# EasyEDA schematic SCH_Syntheseproject line follower_2022-10-21.json
TITLE: Line follower; REV: 1.0; Date: 2022-10-13; Sheet: 1/1; Drawn By: victordv; Company: HOGENT
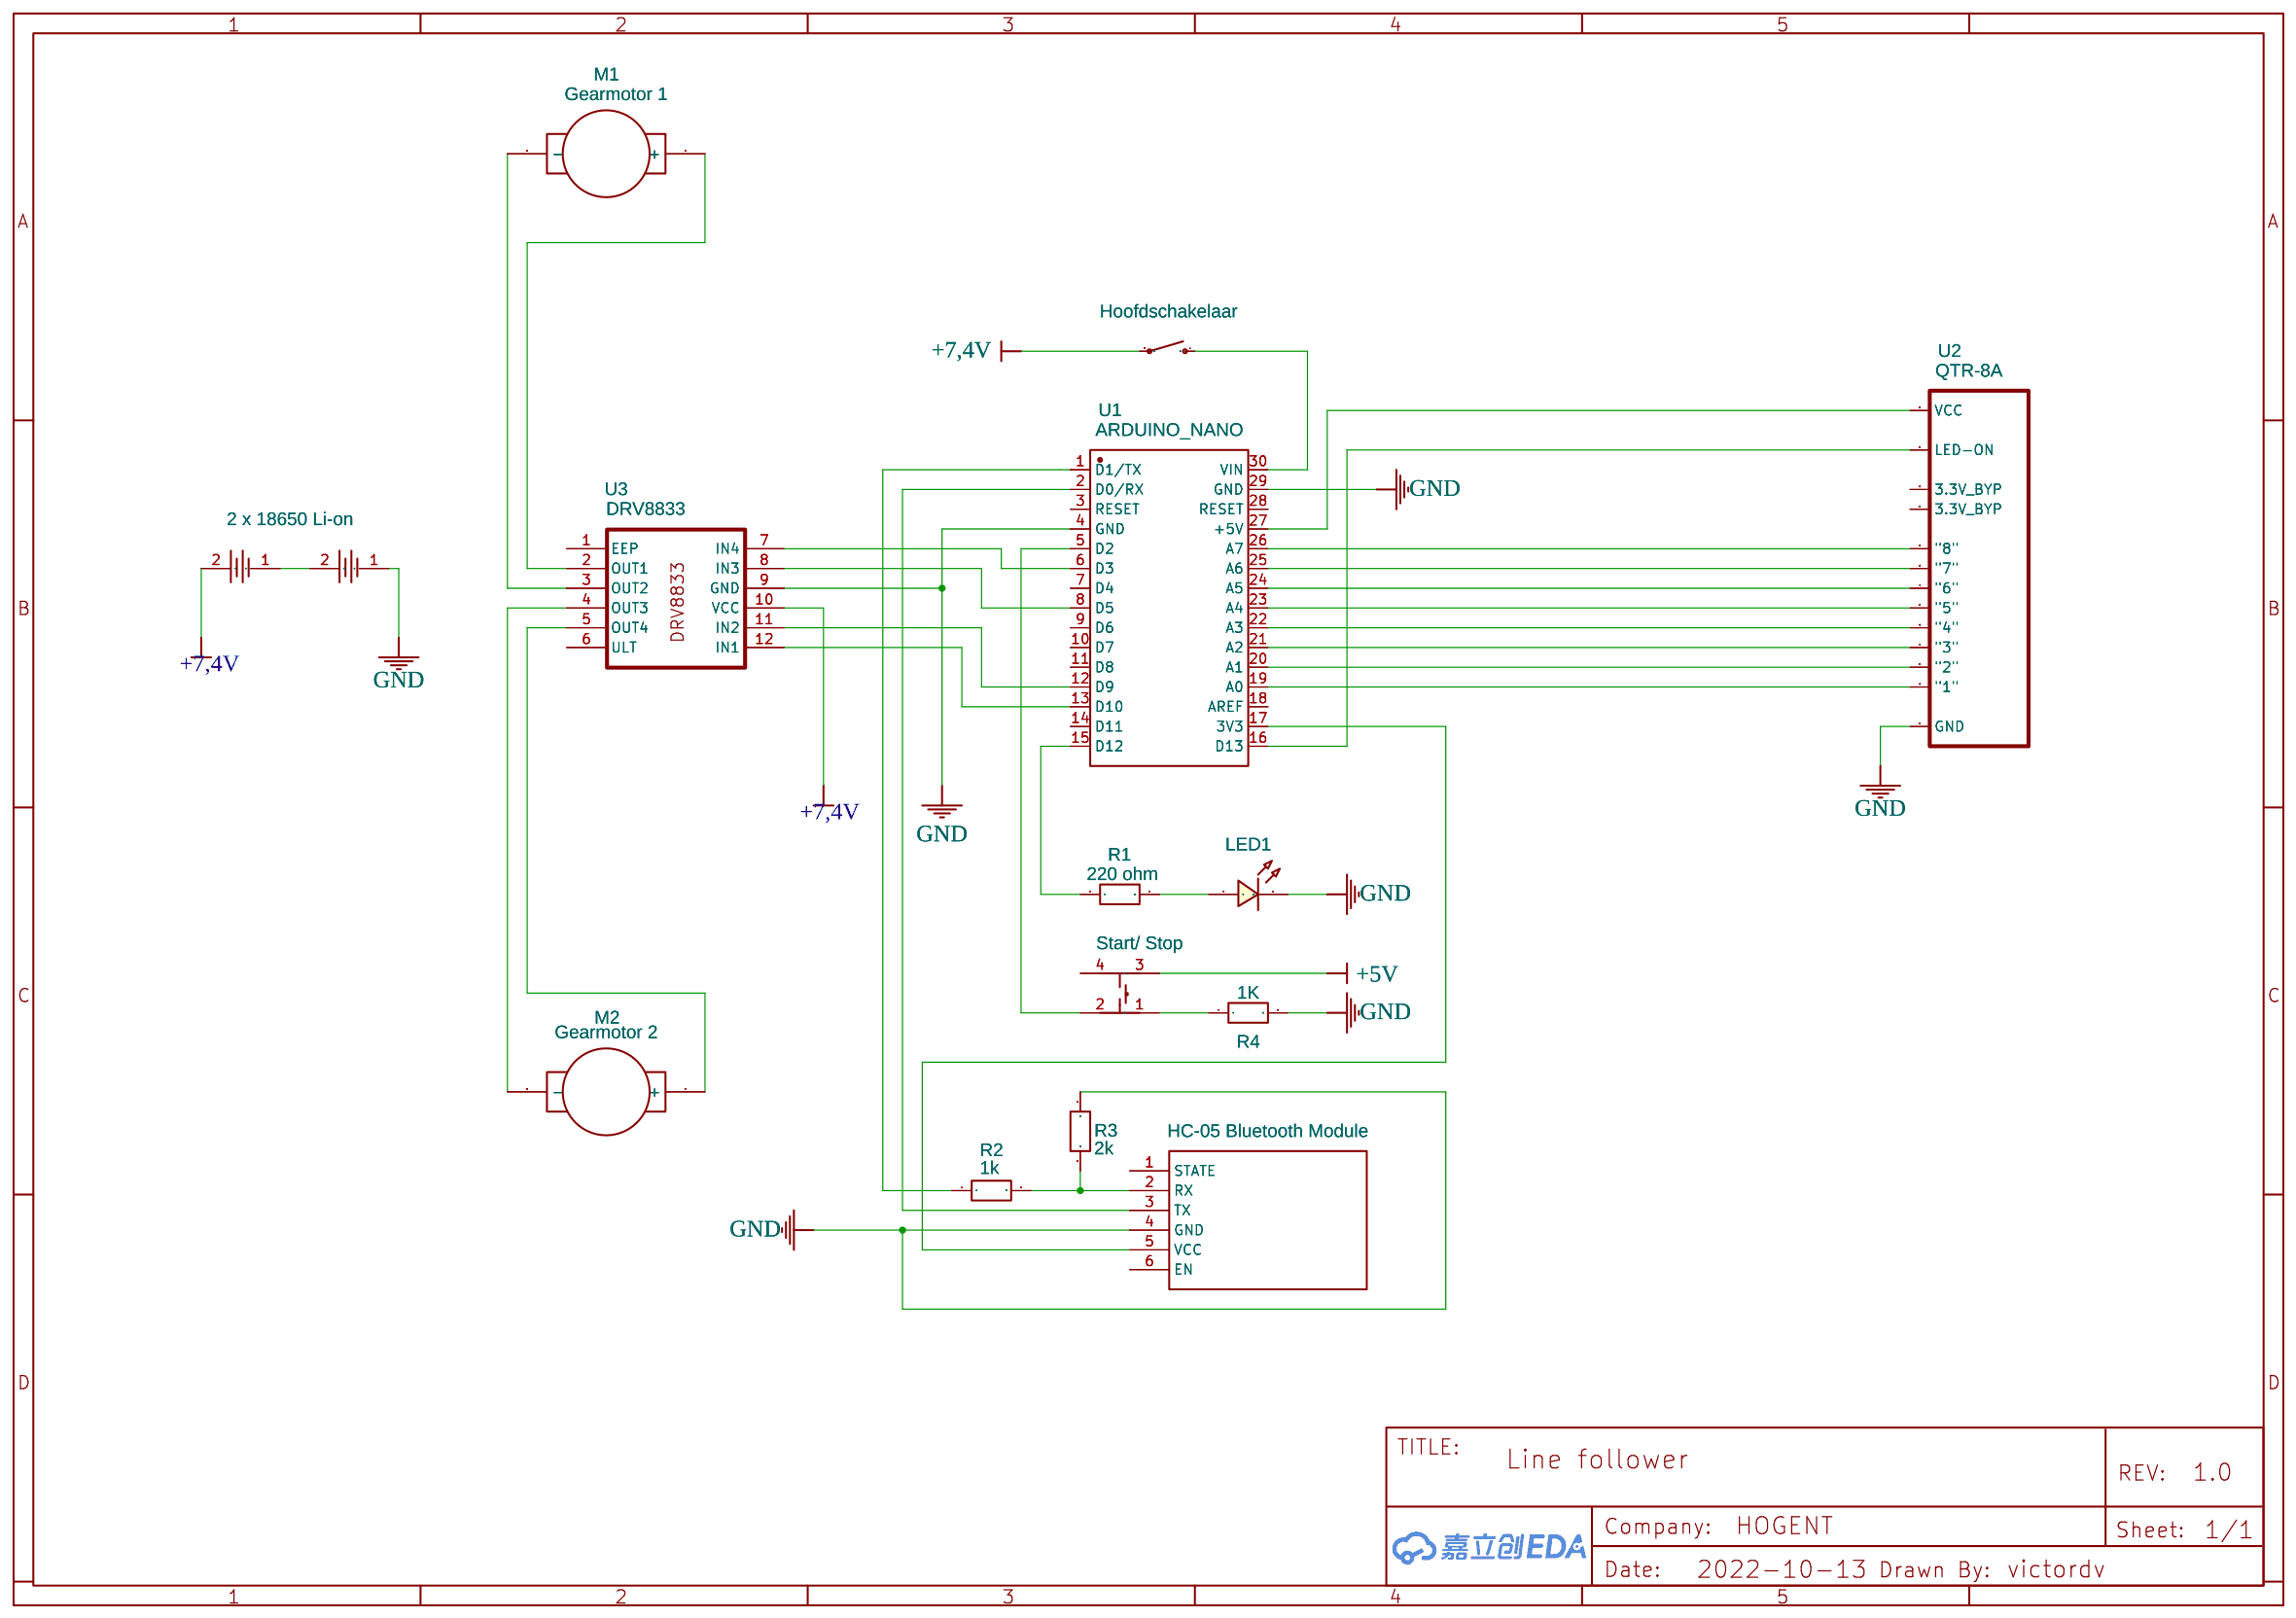
[diagram p0: schematic sheet]

## Parts
BT1  2 x 18650 Li-on  [BATTERY-SMD_18650-1S-L77.1-W20.7-1]
BT2  2 x 18650 Li-on  [BATTERY-SMD_18650-1S-L77.1-W20.7-1]
LED1  LED-0603_R  [LED0603_RED]
M1  Gearmotor 1  [MICRO GEARED DC MOTOR PADS]
M2  Gearmotor 2  [MICRO GEARED DC MOTOR PADS]
R1  220 ohm  [R0603]
R2  1k  [R0603]
R3  2k  [R0603]
R4  1K  [R0603]
SW1  Start/ Stop  [SW-SMD_4P-L4.2-W3.2-P2.15-LS5.2]
U1  ARDUINO_NANO  [COMM-TH_ARDUINO_NANO]
U2  QTR-8A  [QTR-8A/8RC]
U3  DRV8833  [DRV8833 (NO ORIGINAL)]
U4  Hoofdschakelaar  [SWITCHES_TACTILE_SWITCH_SMD_4.6X2.8MM]
U5  HC-05 Bluetooth Module  [HC-05 BLUETOOTH MODULE]

## Library data of the parts
BT1 BT2 = BH-18650-B1BA002: Supplier: LCSC; Supplier Part: C2988620; Manufacturer: MYOUNG(美阳); link: https://atta.szlcsc.com/upload/public/pdf/source/20220402/870DB99AB50CA0DF8D51CF7C86A51FAB.pdf; Contributor: lcsc; JLCPCB Part Class: Extended Part
LED1 = LED-0603_R: Manufacturer: EVERLIGHT(台湾亿光); Manufacturer Part: 19-217/R6C-AL1M2VY/3T; Supplier Part: C72044; Supplier: LCSC; Contributor: LCEDA_01
M1 M2 = Micro Geared DC Motor: link: https://www.amazon.com/dp/B07N7PY71F?psc=1&ref=ppx_yo2ov_dt_b_product_details; Contributor: Guest
R1-R4 = R_0603_EU: Contributor: LCEDA_Lib
SW1 = BUTTON-4X3X2.5: Supplier: LCSC; Supplier Part: C9900020294; Manufacturer: null; JLCPCB Part Class: Extended Part; Contributor: lcsc
U1 = ARDUINO_NANO: Supplier: LCSC; Supplier Part: C9900017879; Manufacturer: null; JLCPCB Part Class: Extended Part; Contributor: lcsc
U2 = QTR-8A: Manufacturer: Pololu; Supplier: Pololu; Supplier Part: 960; link: https://www.pololu.com/docs/pdf/0J12/QTR-8x.pdf; Contributor: Junikos
U3 = DRV8833 (NO ORIGINAL): Contributor: PiterSantaCruz
U4 = SPST Switch: Contributor: baskin1
U5 = HC-05 Bluetooth Module: Contributor: tishangg

## Nets
+5V: SW1.3
GND: BT2.1 LED1.2 R3.1 R4.2 U1.4(GND) U1.29(GND) U2.1(GND) U3.9(GND) U5.4(GND)
+7,4V: BT1.2 U3.10(VCC) U4.2(1)
Net-(BT1-1): BT1.1 BT2.2
Net-(LED1-1): LED1.1 R1.2
Net-(M1-1): M1.1(-) U3.3(OUT2)
Net-(M1-2): M1.2(+) U3.2(OUT1)
Net-(M2-1): M2.1(-) U3.4(OUT3)
Net-(M2-2): M2.2(+) U3.5(OUT4)
Net-(R1-1): R1.1 U1.15(D12)
Net-(R2-1): R2.1 U1.1(D1/TX)
Net-(R2-2): R2.2 R3.2 U5.2(RX)
Net-(R4-1): R4.1 SW1.1
Net-(SW1-2): SW1.2 U1.5(D2)
Net-(U1-2): U1.2(D0/RX) U5.3(TX)
Net-(U1-6): U1.6(D3) U3.7(IN4)
Net-(U1-8): U1.8(D5) U3.8(IN3)
Net-(U1-12): U1.12(D9) U3.11(IN2)
Net-(U1-13): U1.13(D10) U3.12(IN1)
Net-(U1-16): U1.16(D13) U1.27(+5V) U2.12(LED-ON)
Net-(U1-17): U1.17(3V3) U5.5(VCC)
Net-(U1-19): U1.19(A0) U2.2("1")
Net-(U1-20): U1.20(A1) U2.3("2")
Net-(U1-21): U1.21(A2) U2.4("3")
Net-(U1-22): U1.22(A3) U2.5("4")
Net-(U1-23): U1.23(A4) U2.6("5")
Net-(U1-24): U1.24(A5) U2.7("6")
Net-(U1-25): U1.25(A6) U2.8("7")
Net-(U1-26): U1.26(A7) U2.9("8")
Net-(U1-30): U1.30(VIN) U4.4(2)

Not connected (* = marked no-connect by the designer): SW1 4; U1 3(RESET) 7(D4) 9(D6) 10(D7) 11(D8) 14(D11) 18(AREF) 28(RESET); U2 10(3.3V BYP) 11(3.3V BYP); U3 1(EEP) 6(ULT); U5 1(STATE) 6(EN)
